# Altium schematic sheet joystick_n_7seg.SchDoc
size A4; SheetNumber: 1; SheetTotal: 2
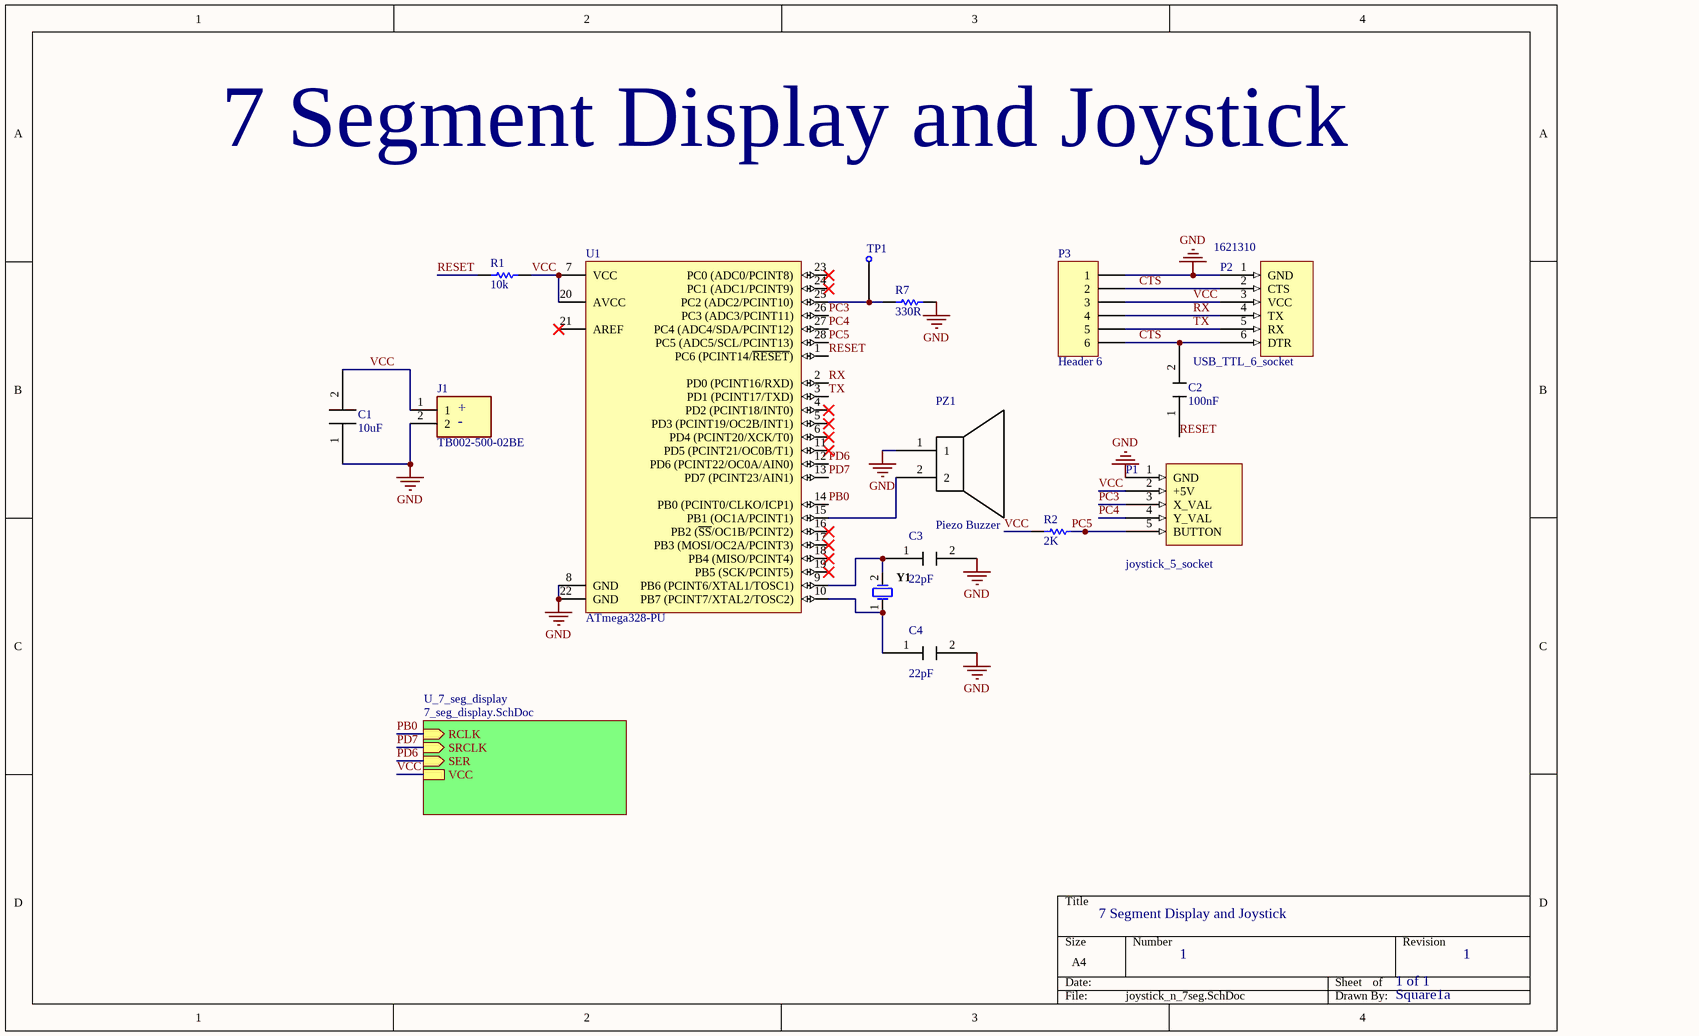
[diagram p0: joystick_n_7seg.SchDoc]

## Parts
C1  10uF  [electrolytic_capacitor]
C2  100nF  [Ceramic Capacitor]
C3  22pF  [Ceramic Capacitor]
C4  22pF  [Ceramic Capacitor]
J1  TB002-500-02BE  [CUI_TB002-500-02BE]
P1  joystick_5_socket  [joystick]
P2  USB_TTL_6_socket  Supplier Part Number 1: 1621310  [TTL USB (6 SOCKETS)]
P3  Header 6  [HDR1X6]
PZ1  Piezo Buzzer  [Buzzer]
R1  10k  [RESA60-630X240]
R2  2K  [RESA60-630X240]
R7  330R  [RESA60-630X240]
TP1  (+5V)  [TEST_POINT]  (value not drawn)
U1  ATmega328-PU  [28P3]
Y1  FOXSLF/160-20  [FOX-FOXSLF160-20]  (value not drawn)

## Sub-sheets
U_7_seg_display = 7_seg_display.SchDoc: SER (in), SRCLK (in), RCLK (in), VCC

## Nets
GND: C1.1 C3.2 C4.2 J1.2 P1.1(GND) P2.1(GND) P3.1 PZ1.1 R7.1 U1.8(GND) U1.22(GND)
CTS: C2.2 P2.2(CTS) P2.6(DTR) P3.2 P3.6
PB0: U1.14(PB0_(PCINT0/CLKO/ICP1)) ; sheet U_7_seg_display/RCLK
PC3: P1.3(X_VAL) U1.26(PC3_(ADC3/PCINT11))
PC4: P1.4(Y_VAL) U1.27(PC4_(ADC4/SDA/PCINT12))
PC5: P1.5(BUTTON) R2.1 U1.28(PC5_(ADC5/SCL/PCINT13))
PD6: U1.12(PD6_(PCINT22/OC0A/AIN0)) ; sheet U_7_seg_display/SER
PD7: U1.13(PD7_(PCINT23/AIN1)) ; sheet U_7_seg_display/SRCLK
RESET: C2.1 R1.2 U1.1(PC6_(PCINT14/~{RESET}))
RX: P2.4(TX) P3.4 U1.2(PD0_(PCINT16/RXD))
TX: P2.5(RX) P3.5 U1.3(PD1_(PCINT17/TXD))
VCC: C1.2 J1.1 P1.2(+5V) P2.3(VCC) P3.3 R1.1 R2.2 U1.7(VCC) U1.20(AVCC) ; sheet U_7_seg_display/VCC
NetC3_1: C3.1 U1.9(PB6_(PCINT6/XTAL1/TOSC1)) Y1.2
NetC4_1: C4.1 U1.10(PB7_(PCINT7/XTAL2/TOSC2)) Y1.1
NetPZ1_2: PZ1.2 U1.15(PB1_(OC1A/PCINT1))
NetR7_2: R7.2 TP1.1 U1.25(PC2_(ADC2/PCINT10))

Not connected (* = marked no-connect by the designer): U1 4(PD2_(PCINT18/INT0))* 5(PD3_(PCINT19/OC2B/INT1))* 6(PD4_(PCINT20/XCK/T0))* 11(PD5_(PCINT21/OC0B/T1))* 16(PB2_(~{SS}/OC1B/PCINT2))* 17(PB3_(MOSI/OC2A/PCINT3))* 18(PB4_(MISO/PCINT4))* 19(PB5_(SCK/PCINT5))* 21(AREF)* 23(PC0_(ADC0/PCINT8))* 24(PC1_(ADC1/PCINT9))*

## Notes on the sheet
- 7 Segment Display and Joystick
- 1
- 1 of 1
- Square1a
- (in symbol TB002-500-02BE) +; -

## Library data of the parts
C1 = electrolytic capacitor
C2-C4 = capacitor
J1 = TB002-500-02BE: 2~24 Poles, Screw Type, Horizontal, 5.0 Pitch, 22~12 (AWG), Terminal Block Connector; MF: CUI Devices; Purchase-URL: https://pricing.snapeda.com/search/part/TB002-500-02BE/?ref=eda; MP: TB002-500-02BE; Package: None; Price: None; Availability: In Stock; SnapEDA_Link: https://www.snapeda.com/parts/TB002-500-02BE/CUI+Devices/view-part/?ref=snap; Value: *; Check_prices: https://www.snapeda.com/parts/TB002-500-02BE/CUI+Devices/view-part/?ref=eda; CUI_purchase_URL: https://www.cuidevices.com/product/interconnect/connectors/terminal-blocks/tb002-500-series?utm_source=snapeda.com&utm_medium=referral&utm_campaign=snapedaBOM
P3 = Header 6: Header, 6-Pin; LatestRevisionDate: 17-Jul-2002; LatestRevisionNote: Re-released for DXP Platform.; Publisher: Altium Limited
PZ1 = TP124005-2: High Temp Piezo Transducer; Resonant Frequency: 4000Hz; Rated Voltage: 5V; SPL @ 10cm: 75dBA; Manufacturer: DB Unlimited; Supplier 1: Digi-Key; Manufacturer Part Number: TP124005-2; RoHS: No; Category: Audio Products; Stock 1: 2115; Pricing 1: 1=0.78000, 10=0.64900, 25=0.60120, 50=0.56620, 100=0.53260 (USD); Supplier Part Number 1: 2104-TP124005-2CT-ND
R1 R2 R7 = CMP-1659-00073-1: Axial Resistor, 100 KOhm, +/- 1%, 0.25 W, -55 to 155 degC, 2-Pin THD, RoHS, Bulk; Voltage Rating: 250 V; Power Rating: 250 mW; Resistance: 475 Ohm; PackageDescription: 2-Pin Axial Lead, Dia 2.4 mm, Body Length 6.3 mm; PackageReference: MFR-25; Length: 0.248 inch; ComponentLink2Description: Datasheet; Packaging: Bulk; DatasheetVersion: Apr-13; Package Quantity: 200; Min Operating Temperature: -55 degC; ComponentLink2URL: http://www.yageo.com/documents/recent/Yageo%20LR_MFR_2013.pdf; RoHSCompliant: true; ComponentLink1URL: http://www.yageo.com/; Tolerance: 1%; Case\Package: Axial; Mount: Through Hole; ComponentLink1Description: Manufacturer URL; Max Operating Temperature: 155 degC
TP1 = Testpoint: Polyurethane Multi-Purpose Cream Adhesive, 10.3 oz Cartridge; Manufacturer: Keystone Electronics; Manufacturer Part Number: 5010; Body Material: Bronze,PBT; Plating: Silver; Number of Ports: 1; Inside Diameter: 1.78mm; Hole Diameter: 1.6mm; Supplier 1: Digi-Key; RoHS: Yes; Category: Connectors; Stock 1: 546313; Pricing 1: 1=0.42000, 25=0.34080, 100=0.30150, 250=0.28304, 500=0.25230, 1000=0.19884, 2500=0.18180, 5000=0.17044 (USD); Mount: Through Hole,PCB; Contact Material: Bronze; Contact Plating: Silver,Tin; Color: Red; Material: Nylon,Bronze,Silver; Housing Color: Red; Insulation Material: Nylon; Packaging: Bulk; Series: THM; Package Quantity: 100; Termination: Through Hole; Orientation: Straight; Length: 11.3mm; Height: 0.445inch; Lead Free: Lead Free; Flammability Rating: UL94 V-0; RoHS Compliant: Yes; REACH SVHC: No SVHC; ComponentLink1URL: https://datasheet.ciiva.com/11744/0900766b8009b7c7-11744920.pdf?src-supplier=RSComponents; ComponentLink1Description: https://datasheet.ciiva.com/11744/0900766b8009b7c7-11744920.pdf?src-supplier=RSComponents; ComponentLink2URL: https://datasheet.ciiva.com/16506/m60-2p60-16506972.pdf?src-supplier=Future+Electronics; ComponentLink2Description: https://datasheet.ciiva.com/16506/m60-2p60-16506972.pdf?src-supplier=Future+Electronics; ComponentLink3URL: https://datasheet.ciiva.com/16883/70182825-16883886.pdf?src-supplier=Allied+Electronics; ComponentLink3Description: https://datasheet.ciiva.com/16883/70182825-16883886.pdf?src-supplier=Allied+Electronics; ComponentLink4URL: https://datasheet.ciiva.com/1454/1703983-1454833.pdf?src-supplier=Element14; ComponentLink4Description: https://datasheet.ciiva.com/1454/1703983-1454833.pdf?src-supplier=Element14; ComponentLink5URL: https://datasheet.ciiva.com/22631/1703983-22631113.pdf?src-supplier=Element14; ComponentLink5Description: https://datasheet.ciiva.com/22631/1703983-22631113.pdf?src-supplier=Element14; ComponentLink6URL: https://datasheet.ciiva.com/2917/5010-2917626.pdf?src-supplier=Digi-Key; ComponentLink6Description: https://datasheet.ciiva.com/2917/5010-2917626.pdf?src-supplier=Digi-Key; Supplier Part Number 1: 36-5010-ND
U1 = CMP-0095-00015-2: 8-bit AVR Microcontroller, 32KB Flash, 1KB EEPROM, 2KB SRAM, 28-pin PDIP, Industrial Grade (-40°C to 85°C); ComponentLink3Description: ATmega48A/48PA/88A/88PA/168A/168PA/328/328P Summary; RevisionNote: DatasheetVersion updated. URLs added.; DatasheetVersion: revD, May-2011; ComponentLink1URL: http://www.atmel.com/; PackageVersion: revB, Sep-2001; PackageDescription: 28-lead (0.300"/7.62mm Wide) Plastic Dual Inline Package (PDIP); PackageReference: 28P3; ComponentLink1Description: Manufacturer URL; ComponentLink2Description: ATmega48A/48PA/88A/88PA/168A/168PA/328/328P Datasheet; ComponentLink3URL: http://www.atmel.com/dyn/resources/prod_documents/8271S.pdf; ComponentLink2URL: http://www.atmel.com/dyn/resources/prod_documents/8271.pdf
Y1 = CMP-1749-00003-1: Resistance Weld Thru-Hole Crystal, 16 MHz, -20 to 70 degC, 2-Pin THD, RoHS, Bulk; Voltage Rating: 250 V; Tolerance: 1%; Resistance: 221 kohm; Case\Package: Axial; Power Rating: 250 mW; RoHSCompliant: true; Package Quantity: 200; Packaging: Bulk; Min Operating Temperature: -55 degC; DatasheetVersion: Mar-15; ComponentLink1URL: http://www.foxonline.com/; Max Operating Temperature: 155 degC; PackageReference: FOXSLF160-20; Mount: Through Hole; PackageDescription: 2-Pin Through Hole Device, Body 11.35 x 4.65 mm; ComponentLink1Description: Manufacturer URL; ComponentLink2URL: http://www.foxonline.com/pdfs/hc49slf.pdf; ComponentLink2Description: Datasheet; Length: 0.248 inch
P2 = USB_TTL_6_socket: Supplier 1: Rs